# Altium project gpa-mgs-485.PrjPCB
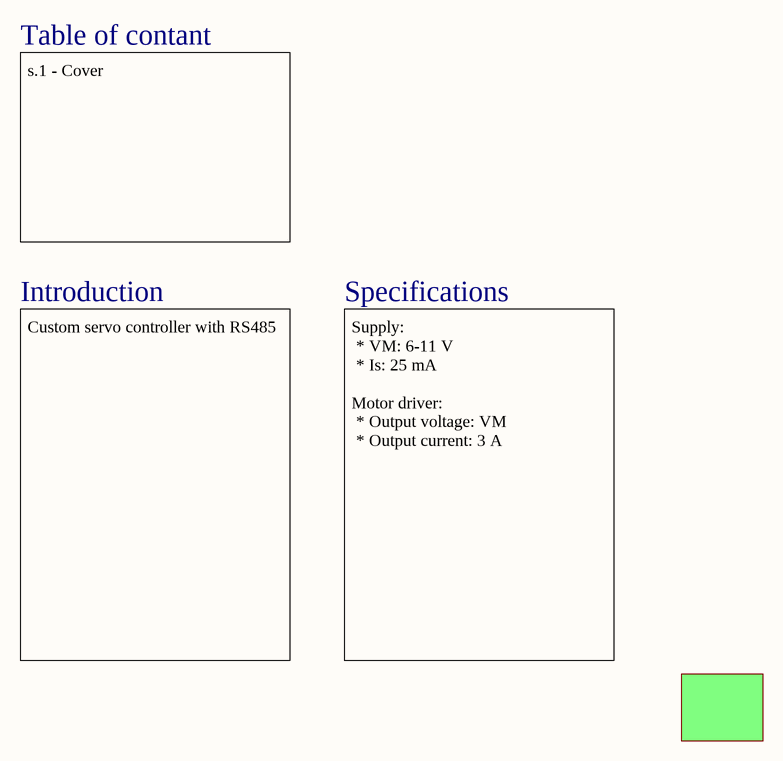
[diagram p0: cover.SchDoc]
project_url: https://github.com/Atmelfan/gpa-mgs-485; project_revision: 2; project_repo: https://github.com/Atmelfan/gpa-mgs-485; project_name: GPA-MGS-485
4 sheets, 30 parts. Net scope: hierarchical (ports join the sheet entries above them; power ports are global).
Board file: gpa-mgs-485.PcbDoc
Sheets:
  cover.SchDoc
    CTL = control.SchDoc
      DRV = motor_drive.SchDoc
      RS485 = external.SchDoc

## Sheet cover.SchDoc: Cover
size A4; Organization: GPA Robotics

### Sub-sheets
CTL = control.SchDoc: no entries

### Notes on the sheet
- Table of contant
- s.1 - Cover
- Introduction
- Specifications
- Custom servo controller with RS485
- Supply:
  * VM: 6-11 V
  * Is: 25 mA
  Motor driver:
  * Output voltage: VM
  * Output current: 3 A
- Variant:
- Title
- Size:
- Date:
- A4
- Number:
- Time:
- Revision:
- Sheet
- of
- Repo:

## Sheet control.SchDoc: Control
size A4; Organization: GPA Robotics; Revision: REV 0
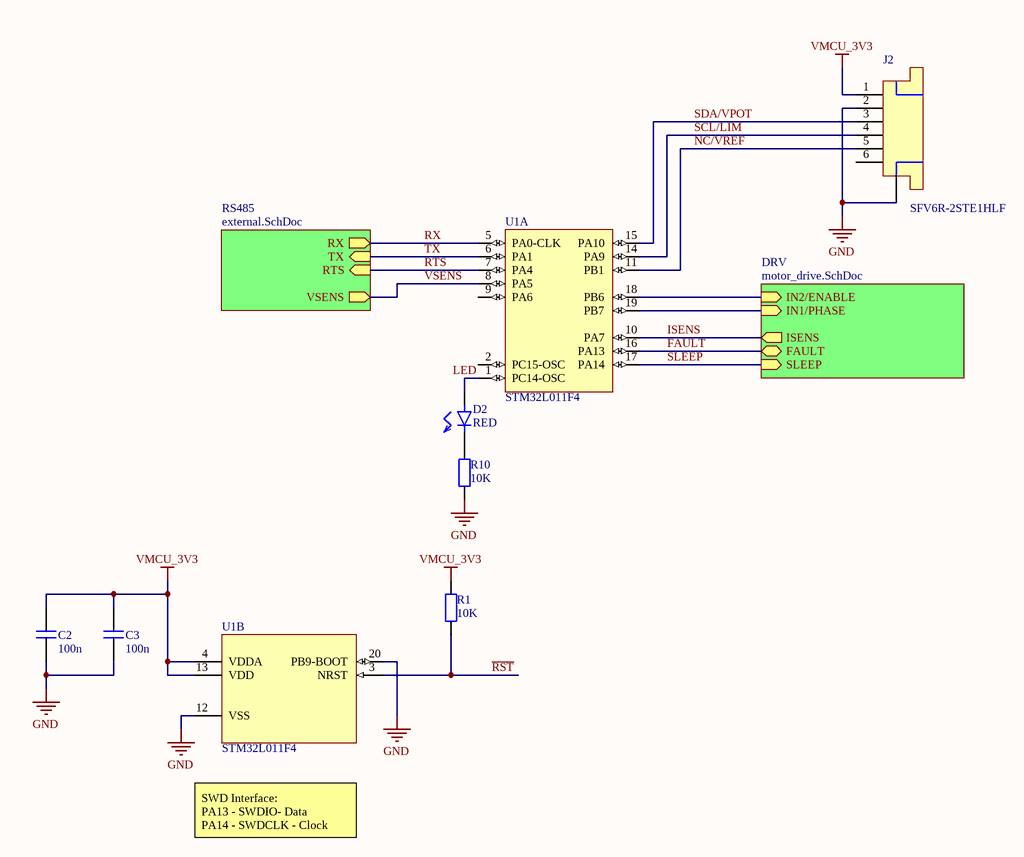
[diagram p1: control.SchDoc]

### Parts
C2  value 100n  [CAPC1005X06N]  (hidden comment: cap)
C3  value 100n  [CAPC1005X06N]  (hidden comment: cap)
D2  value RED  [CAPCP1005X06N]  (hidden comment: led)
J2  SFV6R-2STE1HLF  [SFV6R-2STE1HLF]
R1  value 10K  [RESC1005X04N]  (hidden comment: res)
R10  value 10K  [RESC1005X04N]  (hidden comment: res)
U1  STM32L011F4  [QFN50P300X300X60-20N]  (parts A,B of 2)

### Sub-sheets
DRV = motor_drive.SchDoc: IN2/ENABLE (in), IN1/PHASE (in), ISENS (out), FAULT (bidir), SLEEP (in)
RS485 = external.SchDoc: RX (out), RTS (in), TX (in), VSENS (out)

### Nets
GND: C2.1 C3.1 J2.2 J2.ANCHOR R10.1 U1.12(VSS) U1.20(PB9-BOOT)
VMCU_3V3: C2.2 C3.2 J2.1 R1.2 U1.4(VDDA) U1.13(VDD)
~{RST}: R1.1 U1.3(NRST)
FAULT: U1.16(PA13) ; sheet DRV/FAULT
ISENS: U1.10(PA7) ; sheet DRV/ISENS
LED: D2.A U1.1(PC14-OSC)
NC/VREF: J2.5 U1.11(PB1)
RTS: U1.7(PA4) ; sheet RS485/RTS
RX: U1.5(PA0-CLK) ; sheet RS485/RX
SCL/LIM: J2.4 U1.14(PA9)
SDA/VPOT: J2.3 U1.15(PA10)
SLEEP: U1.17(PA14) ; sheet DRV/SLEEP
TX: U1.6(PA1) ; sheet RS485/TX
VSENS: U1.8(PA5) ; sheet RS485/VSENS
NetD2_C: D2.C R10.2
NetU1_18: U1.18(PB6) ; sheet DRV/IN2/ENABLE
NetU1_19: U1.19(PB7) ; sheet DRV/IN1/PHASE

Not connected (* = marked no-connect by the designer): J2 6; U1 2(PC15-OSC) 9(PA6)

### Notes on the sheet
- SWD Interface:
  PA13 - SWDIO- Data
  PA14 - SWDCLK - Clock
- Title
- Size:
- Date:
- A4
- Number:
- Time:
- Revision:
- Sheet
- of
- Repo:

### Library data of the parts
C2 C3 = cap: Capacitor; voltage: *; type: *; #digikey: *; #mouser: *
D2 = led: pin to pad: A>1 C>2
J2 = sfv6r-2ste1hlf: 6 Position FFC, FPC Connector Contacts, Top 0.020" (0.50mm) Surface Mount, Right Angle; ComponentLink1Description: Datasheet; ComponentLink1URL: https://cdn.amphenol-icc.com/media/wysiwyg/files/drawing/10112793.pdf; #digikey: *; #mouser: *
R1 R10 = res: Resistor; power: *; voltage: *; #digikey: *; #mouser: *
U1 = stm32l011f4u

## Sheet motor_drive.SchDoc
size A4; Organization: GPA Robotics; Revision: REV 0
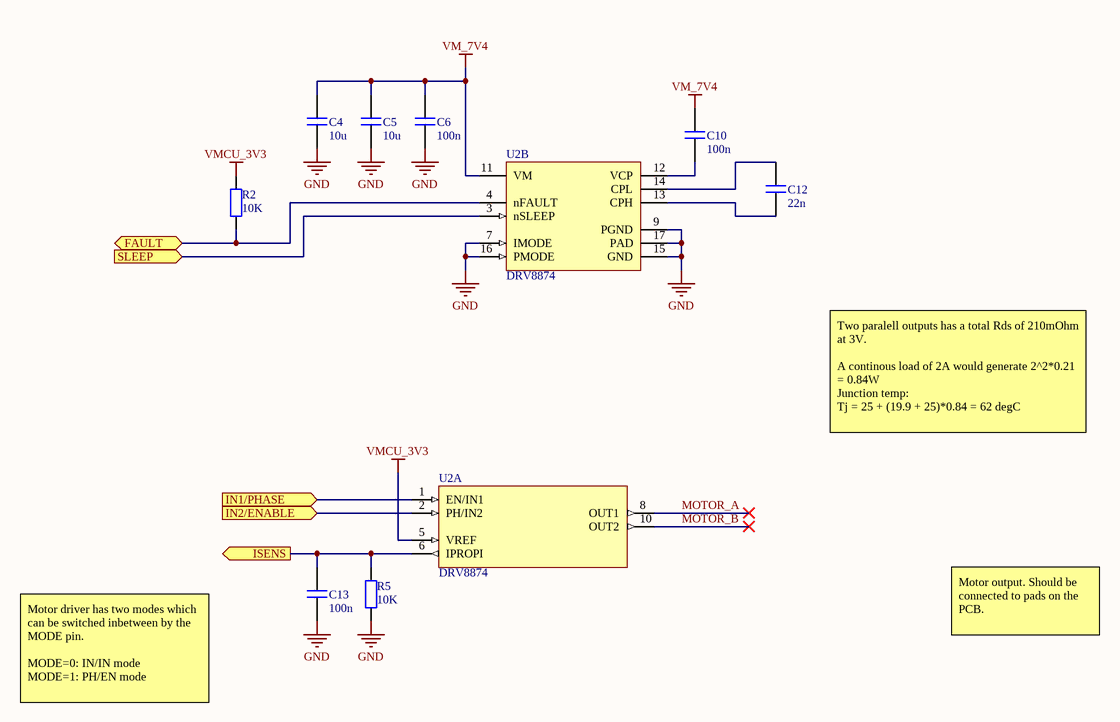
[diagram p2: motor_drive.SchDoc]

### Parts
C4  value 10u  [CAPC3216X14N]  (hidden comment: cap)
C5  value 10u  [CAPC3216X14N]  (hidden comment: cap)
C6  value 100n  [CAPC1005X06N]  (hidden comment: cap)
C10  value 100n  [CAPC1005X06N]  (hidden comment: cap)
C12  value 22n  [CAPC1005X06N]  (hidden comment: cap)
C13  value 100n  [CAPC1005X06N]  (hidden comment: cap)
R2  value 10K  [RESC1005X04N]  (hidden comment: res)
R5  value 10K  [RESC1005X04N]  (hidden comment: res)
U2  DRV8874  [TSOP65P640X120_HS-17N_DRV8874]  (parts A,B of 2)

### Ports
FAULT (bidir), IN1/PHASE (in), IN2/ENABLE (in), ISENS (out), SLEEP (in)

### Nets
GND: C4.1 C5.1 C6.1 C13.1 R5.1 U2.7(IMODE) U2.9(PGND) U2.15(GND) U2.16(PMODE) U2.17(PAD)
VM_7V4: C4.2 C5.2 C6.2 C10.2 U2.11(VM)
VMCU_3V3: R2.2 U2.5(VREF)
FAULT: R2.1 U2.4(nFAULT) ; port FAULT
ISENS: C13.2 R5.2 U2.6(IPROPI) ; port ISENS
MOTOR_A: U2.8(OUT1)
MOTOR_B: U2.10(OUT2)
SLEEP: U2.3(nSLEEP) ; port SLEEP
NetC10_1: C10.1 U2.12(VCP)
NetC12_1: C12.1 U2.13(CPH)
NetC12_2: C12.2 U2.14(CPL)
NetU1_18: U2.2(PH/IN2) ; port IN2/ENABLE
NetU1_19: U2.1(EN/IN1) ; port IN1/PHASE

### Notes on the sheet
- Two paralell outputs has a total Rds of 210mOhm at 3V.
  A continous load of 2A would generate 2^2*0.21 = 0.84W
  Junction temp:
  Tj = 25 + (19.9 + 25)*0.84 = 62 degC
- Motor output. Should be connected to pads on the PCB.
- Motor driver has two modes which can be switched inbetween by the MODE pin.
  MODE=0: IN/IN mode
  MODE=1: PH/EN mode
- Title
- Size:
- Date:
- A4
- Number:
- Time:
- Revision:
- Sheet
- of
- Repo:

### Library data of the parts
C4-C6 C10 C12 C13 = cap: Capacitor; voltage: *; type: *; #digikey: *; #mouser: *
R2 R5 = res: Resistor; power: *; voltage: *; #digikey: *; #mouser: *
U2 = drv8874: H-Bridge Motor Driver With Integrated Current Sense and Regulation; ComponentLink1Description: Datasheet; ComponentLink1URL: http://www.ti.com/lit/gpn/drv8874

## Sheet external.SchDoc
size A4; Organization: GPA Robotics; Revision: REV 0
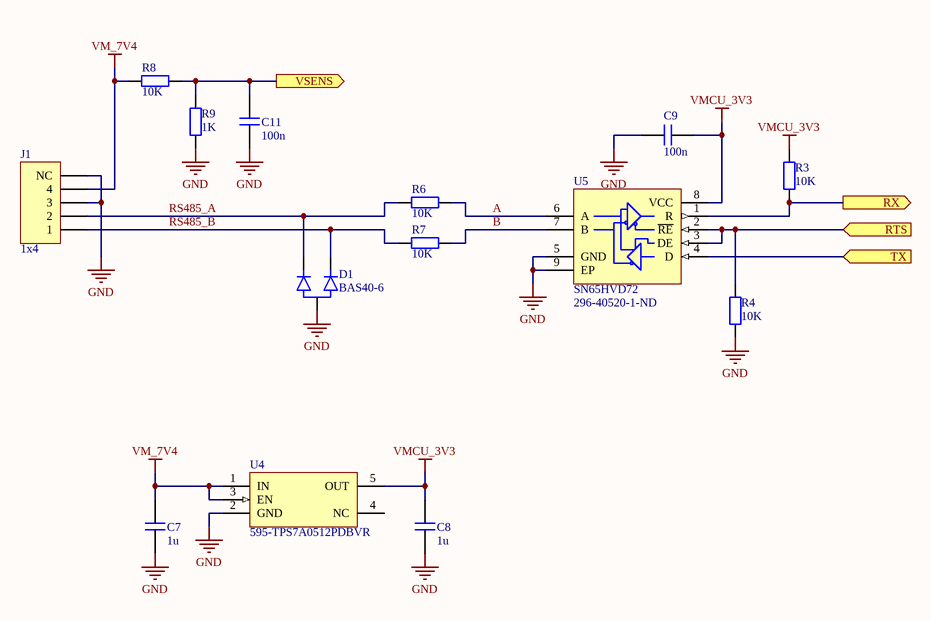
[diagram p3: external.SchDoc]

### Parts
C7  value 1u  [CAPC2012X11N]  (hidden comment: cap)
C8  value 1u  [CAPC2012X11N]  (hidden comment: cap)
C9  value 100n  [CAPC1005X06N]  (hidden comment: cap)
C11  value 100n  [CAPC1005X06N]  (hidden comment: cap)
D1  BAS40-6  [SOT23_CA]
J1  1x4  [sm04b-pass]
R3  value 10K  [RESC1005X04N]  (hidden comment: res)
R4  value 10K  [RESC1005X04N]  (hidden comment: res)
R6  value 10K  [RESC1005X04N]  (hidden comment: res)
R7  value 10K  [RESC1005X04N]  (hidden comment: res)
R8  value 10K  [RESC1005X04N]  (hidden comment: res)
R9  value 1K  [RESC1005X04N]  (hidden comment: res)
U4  595-TPS7A0512PDBVR  [SOT95P280X145-5N]
U5  SN65HVD72  Supplier Part Number 1: 296-40520-1-ND  [SON65P300X100_HS-9N]

### Ports
RTS (in), RX (out), TX (in), VSENS (out)

### Nets
GND: C7.1 C8.1 C9.2 C11.1 D1.A J1.3 J1.ANCHOR(NC) R4.1 R9.1 U4.2(GND) U5.5(GND) U5.9(EP)
VM_7V4: C7.2 J1.4 R8.2 U4.1(IN) U4.3(EN)
VMCU_3V3: C8.2 C9.1 R3.2 U4.5(OUT) U5.8(VCC)
A: R6.2 U5.6(A)
B: R7.2 U5.7(B)
RS485_A: D1.C2 J1.2 R6.1
RS485_B: D1.C1 J1.1 R7.1
RTS: R4.2 U5.2(~{RE}) U5.3(DE) ; port RTS
RX: R3.1 U5.1(R) ; port RX
TX: U5.4(D) ; port TX
VSENS: C11.2 R8.1 R9.2 ; port VSENS

Not connected (* = marked no-connect by the designer): U4 4(NC)

### Notes on the sheet
- Title
- Size:
- Date:
- A4
- Number:
- Time:
- Revision:
- Sheet
- of
- Repo:

### Library data of the parts
C7-C9 C11 = cap: Capacitor; voltage: *; type: *; #digikey: *; #mouser: *
D1 = diode_dual_ca: Diode Common Anode
J1 = sm04b-pass: 2.0mm pitch/Wire-to-board (Crimp style/IDC) / Wire-to-wire (Crimp style/IDC); ComponentLink1Description: Datasheet; ComponentLink1URL: http://www.jst-mfg.com/product/pdf/eng/ePA-F.pdf; #digikey: *; #mouser: *
R3 R4 R6-R9 = res: Resistor; power: *; voltage: *; #digikey: *; #mouser: *
U4 = tps7a0512pdbvr: TPS7A05 1-µA Ultralow IQ, 200-mA, Low-Dropout Regulator; ComponentLink1Description: datasheet; ComponentLink1URL: http://www.ti.com/lit/ds/symlink/tps7a05.pdf?HQS=TI-null-null-mousermode-df-pf-null-wwe&DCM=yes&ref_url=https%3A%2F%2Fwww.mouser.se%2F
U5 = sn65hvd72: 3.3-V Supply RS-485 With IEC ESD Protection; ComponentLink1Description: Datasheet; ComponentLink1URL: http://www.ti.com/lit/ds/symlink/sn65hvd72.pdf; #digikey: *; #mouser: *; Supplier 1: Digi-Key

## Nets that join several sheets
GND: control (7 pins), motor_drive (10 pins), external (12 pins)
VM_7V4: motor_drive (5 pins), external (5 pins)
VMCU_3V3: control (6 pins), motor_drive (R2.2 U2.5), external (5 pins)
FAULT: control (U1.16), motor_drive (R2.1 U2.4)
ISENS: control (U1.10), motor_drive (C13.2 R5.2 U2.6)
NetU1_18: control (U1.18), motor_drive (U2.2)
NetU1_19: control (U1.19), motor_drive (U2.1)
RTS: control (U1.7), external (R4.2 U5.2 U5.3)
RX: control (U1.5), external (R3.1 U5.1)
SLEEP: control (U1.17), motor_drive (U2.3)
TX: control (U1.6), external (U5.4)
VSENS: control (U1.8), external (C11.2 R8.1 R9.2)